# EAGLE design B250D (EAGLE 6.6.0)
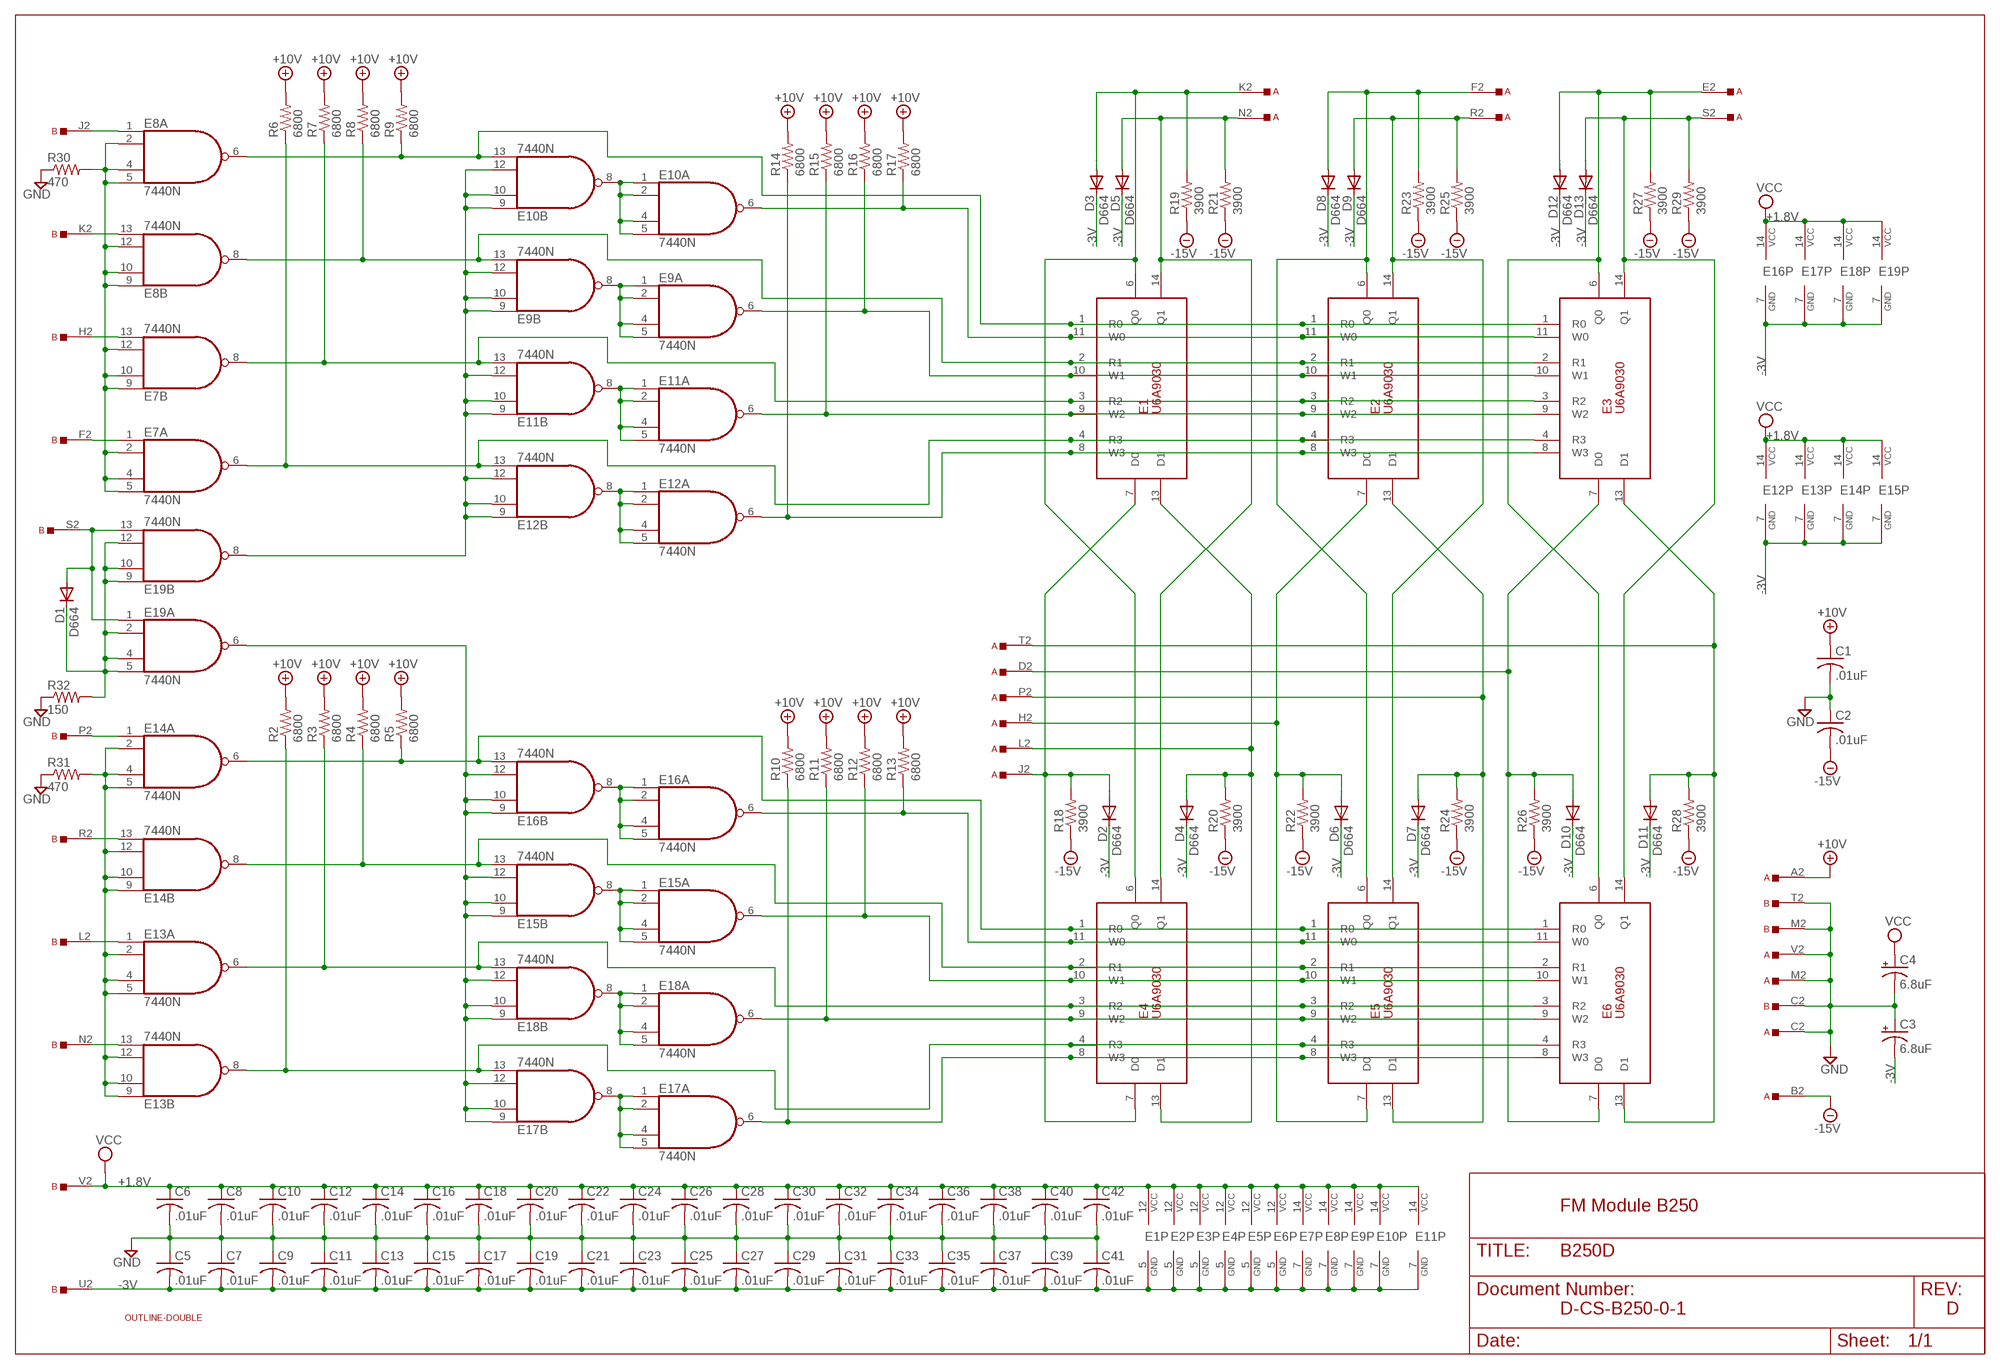
[diagram p0: schematic, sheet 1]

## Parts
A  SS-TOP  [EDGE-CON1]
B  SS-TOP  [EDGE-CON1]
C1  .01uF  C-US  [C063-025X075]
C2  .01uF  C-US  [C063-025X075]
C3  6.8uF  CPOL-USE15-5AXIAL  [E15-5]
C4  6.8uF  CPOL-USE15-5AXIAL  [E15-5]
C5  .01uF  C-US  [C063-025X075]
C6  .01uF  C-US  [C063-025X075]
C7  .01uF  C-US  [C063-025X075]
C8  .01uF  C-US  [C063-025X075]
C9  .01uF  C-US  [C063-025X075]
C10  .01uF  C-US  [C063-025X075]
C11  .01uF  C-US  [C063-025X075]
C12  .01uF  C-US  [C063-025X075]
C13  .01uF  C-US  [C063-025X075]
C14  .01uF  C-US  [C063-025X075]
C15  .01uF  C-US  [C063-025X075]
C16  .01uF  C-US  [C063-025X075]
C17  .01uF  C-US  [C063-025X075]
C18  .01uF  C-US  [C063-025X075]
C19  .01uF  C-US  [C063-025X075]
C20  .01uF  C-US  [C063-025X075]
C21  .01uF  C-US  [C063-025X075]
C22  .01uF  C-US  [C063-025X075]
C23  .01uF  C-US  [C063-025X075]
C24  .01uF  C-US  [C063-025X075]
C25  .01uF  C-US  [C063-025X075]
C26  .01uF  C-US  [C063-025X075]
C27  .01uF  C-US  [C063-025X075]
C28  .01uF  C-US  [C063-025X075]
C29  .01uF  C-US  [C063-025X075]
C30  .01uF  C-US  [C063-025X075]
C31  .01uF  C-US  [C063-025X075]
C32  .01uF  C-US  [C063-025X075]
C33  .01uF  C-US  [C063-025X075]
C34  .01uF  C-US  [C063-025X075]
C35  .01uF  C-US  [C063-025X075]
C36  .01uF  C-US  [C063-025X075]
C37  .01uF  C-US  [C063-025X075]
C38  .01uF  C-US  [C063-025X075]
C39  .01uF  C-US  [C063-025X075]
C40  .01uF  C-US  [C063-025X075]
C41  .01uF  C-US  [C063-025X075]
C42  .01uF  C-US  [C063-025X075]
D1  D664  DIODE-DO35-10  [DO35-10]
D2  D664  DIODE-DO35-10  [DO35-10]
D3  D664  DIODE-DO35-10  [DO35-10]
D4  D664  DIODE-DO35-10  [DO35-10]
D5  D664  DIODE-DO35-10  [DO35-10]
D6  D664  DIODE-DO35-10  [DO35-10]
D7  D664  DIODE-DO35-10  [DO35-10]
D8  D664  DIODE-DO35-10  [DO35-10]
D9  D664  DIODE-DO35-10  [DO35-10]
D10  D664  DIODE-DO35-10  [DO35-10]
D11  D664  DIODE-DO35-10  [DO35-10]
D12  D664  DIODE-DO35-10  [DO35-10]
D13  D664  DIODE-DO35-10  [DO35-10]
E1  U6A9030  [DIL14]
E2  U6A9030  [DIL14]
E3  U6A9030  [DIL14]
E4  U6A9030  [DIL14]
E5  U6A9030  [DIL14]
E6  U6A9030  [DIL14]
E7  7440N  [DIL14]
E8  7440N  [DIL14]
E9  7440N  [DIL14]
E10  7440N  [DIL14]
E11  7440N  [DIL14]
E12  7440N  [DIL14]
E13  7440N  [DIL14]
E14  7440N  [DIL14]
E15  7440N  [DIL14]
E16  7440N  [DIL14]
E17  7440N  [DIL14]
E18  7440N  [DIL14]
E19  7440N  [DIL14]
R2  6800  R-US_0207/10  [0207/10]
R3  6800  R-US_0207/10  [0207/10]
R4  6800  R-US_0207/10  [0207/10]
R5  6800  R-US_0207/10  [0207/10]
R6  6800  R-US_0207/10  [0207/10]
R7  6800  R-US_0207/10  [0207/10]
R8  6800  R-US_0207/10  [0207/10]
R9  6800  R-US_0207/10  [0207/10]
R10  6800  R-US_0207/10  [0207/10]
R11  6800  R-US_0207/10  [0207/10]
R12  6800  R-US_0207/10  [0207/10]
R13  6800  R-US_0207/10  [0207/10]
R14  6800  R-US_0207/10  [0207/10]
R15  6800  R-US_0207/10  [0207/10]
R16  6800  R-US_0207/10  [0207/10]
R17  6800  R-US_0207/10  [0207/10]
R18  3900  R-US_0207/10  [0207/10]
R19  3900  R-US_0207/10  [0207/10]
R20  3900  R-US_0207/10  [0207/10]
R21  3900  R-US_0207/10  [0207/10]
R22  3900  R-US_0207/10  [0207/10]
R23  3900  R-US_0207/10  [0207/10]
R24  3900  R-US_0207/10  [0207/10]
R25  3900  R-US_0207/10  [0207/10]
R26  3900  R-US_0207/10  [0207/10]
R27  3900  R-US_0207/10  [0207/10]
R28  3900  R-US_0207/10  [0207/10]
R29  3900  R-US_0207/10  [0207/10]
R30  470  R-US_0207/10  [0207/10]
R31  470  R-US_0207/10  [0207/10]
R32  150  R-US_0207/10  [0207/10]
U$1  OUTLINE-DOUBLE  [DOUBLE]

## Nets
+10V [supply]: A.A2 C1.1 R2.2 R3.2 R4.2 R5.2 R6.2 R7.2 R8.2 R9.2 R10.2 R11.2 R12.2 R13.2 R14.2 R15.2 R16.2 R17.2
-3V [supply]: B.U2 C3.- C5.2 C7.2 C9.2 C11.2 C13.2 C15.2 C17.2 C19.2 C21.2 C23.2 C25.2 C27.2 C29.2 C31.2 C33.2 C35.2 C37.2 C39.2 C41.2 D2.C D3.C D4.C D5.C D6.C D7.C D8.C D9.C D10.C D11.C D12.C D13.C E1.5(GND) E2.5(GND) E3.5(GND) E4.5(GND) E5.5(GND) E6.5(GND) E7.7(P:GND) E8.7(P:GND) E9.7(P:GND) E10.7(P:GND) E11.7(P:GND) E12.7(P:GND) E13.7(P:GND) E14.7(P:GND) E15.7(P:GND) E16.7(P:GND) E17.7(P:GND) E18.7(P:GND) E19.7(P:GND)
-15V [supply]: A.B2 C2.2 R18.1 R19.1 R20.1 R21.1 R22.1 R23.1 R24.1 R25.1 R26.1 R27.1 R28.1 R29.1
GND [supply]: A.C2 A.M2 A.V2 B.C2 B.M2 B.T2 C1.2 C2.1 C3.+ C4.- C5.1 C6.2 C7.1 C8.2 C9.1 C10.2 C11.1 C12.2 C13.1 C14.2 C15.1 C16.2 C17.1 C18.2 C19.1 C20.2 C21.1 C22.2 C23.1 C24.2 C25.1 C26.2 C27.1 C28.2 C29.1 C30.2 C31.1 C32.2 C33.1 C34.2 C35.1 C36.2 C37.1 C38.2 C39.1 C40.2 C41.1 C42.2 R30.1 R31.1 R32.1
N$1: E13.2(A:I1) E13.4(A:I2) E13.5(A:I3) E13.9(B:I0) E13.10(B:I1) E13.12(B:I2) E14.2(A:I1) E14.4(A:I2) E14.5(A:I3) E14.9(B:I0) E14.10(B:I1) E14.12(B:I2) R31.2
N$2: E7.2(A:I1) E7.4(A:I2) E7.5(A:I3) E7.9(B:I0) E7.10(B:I1) E7.12(B:I2) E8.2(A:I1) E8.4(A:I2) E8.5(A:I3) E8.9(B:I0) E8.10(B:I1) E8.12(B:I2) R30.2
N$3: B.S2 D1.A E19.1(A:I0) E19.13(B:I3)
N$4: D1.C E19.2(A:I1) E19.4(A:I2) E19.5(A:I3) E19.9(B:I0) E19.10(B:I1) E19.12(B:I2) R32.2
N$5: E17.1(A:I0) E17.2(A:I1) E17.4(A:I2) E17.5(A:I3) E17.8(B:O)
N$6: E18.1(A:I0) E18.2(A:I1) E18.4(A:I2) E18.5(A:I3) E18.8(B:O)
N$7: E15.1(A:I0) E15.2(A:I1) E15.4(A:I2) E15.5(A:I3) E15.8(B:O)
N$8: E16.1(A:I0) E16.2(A:I1) E16.4(A:I2) E16.5(A:I3) E16.8(B:O)
N$9: E12.1(A:I0) E12.2(A:I1) E12.4(A:I2) E12.5(A:I3) E12.8(B:O)
N$10: E11.1(A:I0) E11.2(A:I1) E11.4(A:I2) E11.5(A:I3) E11.8(B:O)
N$11: E9.1(A:I0) E9.2(A:I1) E9.4(A:I2) E9.5(A:I3) E9.8(B:O)
N$12: E10.1(A:I0) E10.2(A:I1) E10.4(A:I2) E10.5(A:I3) E10.8(B:O)
N$13: B.H2 E7.13(B:I3)
N$14: B.J2 E8.1(A:I0)
N$15: B.K2 E8.13(B:I3)
N$16: B.F2 E7.1(A:I0)
N$17: B.L2 E13.1(A:I0)
N$18: B.P2 E14.1(A:I0)
N$19: B.R2 E14.13(B:I3)
N$20: B.N2 E13.13(B:I3)
N$21: E15.9(B:I0) E15.10(B:I1) E15.12(B:I2) E16.9(B:I0) E16.10(B:I1) E16.12(B:I2) E17.9(B:I0) E17.10(B:I1) E17.12(B:I2) E18.9(B:I0) E18.10(B:I1) E18.12(B:I2) E19.6(A:O)
N$22: E9.9(B:I0) E9.10(B:I1) E9.12(B:I2) E10.9(B:I0) E10.10(B:I1) E10.12(B:I2) E11.9(B:I0) E11.10(B:I1) E11.12(B:I2) E12.9(B:I0) E12.10(B:I1) E12.12(B:I2) E19.8(B:O)
N$23: E1.4(R3) E2.4(R3) E3.4(R3) E7.6(A:O) E12.13(B:I3) R6.1
N$24: E1.3(R2) E2.3(R2) E3.3(R2) E7.8(B:O) E11.13(B:I3) R7.1
N$25: E1.2(R1) E2.2(R1) E3.2(R1) E8.8(B:O) E9.13(B:I3) R8.1
N$26: E1.1(R0) E2.1(R0) E3.1(R0) E8.6(A:O) E10.13(B:I3) R9.1
N$27: E4.4(R3) E5.4(R3) E6.4(R3) E13.8(B:O) E17.13(B:I3) R2.1
N$28: E4.3(R2) E5.3(R2) E6.3(R2) E13.6(A:O) E18.13(B:I3) R3.1
N$29: E4.2(R1) E5.2(R1) E6.2(R1) E14.8(B:O) E15.13(B:I3) R4.1
N$30: E4.1(R0) E5.1(R0) E6.1(R0) E14.6(A:O) E16.13(B:I3) R5.1
N$31: E1.8(W3) E2.8(W3) E3.8(W3) E12.6(A:O) R14.1
N$32: E1.9(W2) E2.9(W2) E3.9(W2) E11.6(A:O) R15.1
N$33: E1.10(W1) E2.10(W1) E3.10(W1) E9.6(A:O) R16.1
N$34: E1.11(W0) E2.11(W0) E3.11(W0) E10.6(A:O) R17.1
N$35: E4.8(W3) E5.8(W3) E6.8(W3) E17.6(A:O) R10.1
N$36: E4.11(W0) E5.11(W0) E6.11(W0) E16.6(A:O) R13.1
N$37: E4.10(W1) E5.10(W1) E6.10(W1) E15.6(A:O) R12.1
N$38: E4.9(W2) E5.9(W2) E6.9(W2) E18.6(A:O) R11.1
N$39: A.J2 D2.A E1.7(D0) E4.7(D0) R18.2
N$40: A.K2 D3.A E1.6(Q0) E4.6(Q0) R19.2
N$41: A.N2 D5.A E1.14(Q1) E4.14(Q1) R21.2
N$42: A.F2 D8.A E2.6(Q0) E5.6(Q0) R23.2
N$43: A.L2 D4.A E1.13(D1) E4.13(D1) R20.2
N$44: A.H2 D6.A E2.7(D0) E5.7(D0) R22.2
N$45: A.P2 D7.A E2.13(D1) E5.13(D1) R24.2
N$46: A.D2 D10.A E3.7(D0) E6.7(D0) R26.2
N$47: A.R2 D9.A E2.14(Q1) E5.14(Q1) R25.2
N$48: A.S2 D13.A E3.14(Q1) E6.14(Q1) R29.2
N$49: A.E2 D12.A E3.6(Q0) E6.6(Q0) R27.2
N$52: A.T2 D11.A E3.13(D1) E6.13(D1) R28.2
VCC [supply]: B.V2 C4.+ C6.1 C8.1 C10.1 C12.1 C14.1 C16.1 C18.1 C20.1 C22.1 C24.1 C26.1 C28.1 C30.1 C32.1 C34.1 C36.1 C38.1 C40.1 C42.1 E1.12(VCC) E2.12(VCC) E3.12(VCC) E4.12(VCC) E5.12(VCC) E6.12(VCC) E7.14(P:VCC) E8.14(P:VCC) E9.14(P:VCC) E10.14(P:VCC) E11.14(P:VCC) E12.14(P:VCC) E13.14(P:VCC) E14.14(P:VCC) E15.14(P:VCC) E16.14(P:VCC) E17.14(P:VCC) E18.14(P:VCC) E19.14(P:VCC)
Unconnected: A.U2 B.A2 B.B2 B.D2 B.E2 E7.3(3:NC) E7.11(11:NC) E8.3(3:NC) E8.11(11:NC) E9.3(3:NC) E9.11(11:NC) E10.3(3:NC) E10.11(11:NC) E11.3(3:NC) E11.11(11:NC) E12.3(3:NC) E12.11(11:NC) E13.3(3:NC) E13.11(11:NC) E14.3(3:NC) E14.11(11:NC) E15.3(3:NC) E15.11(11:NC) E16.3(3:NC) E16.11(11:NC) E17.3(3:NC) E17.11(11:NC) E18.3(3:NC) E18.11(11:NC) E19.3(3:NC) E19.11(11:NC)

## Notes on the sheet
- +1.8V
- +1.8V
- +1.8V
- FM Module B250
- D-CS-B250-0-1 | D

## Library data of the parts
A B = dec-con:SS-TOP: Single Sided Top Connector. Also suitable for building wider single-sided modules.
C1 C2 C5-C42 = dec-con:C-US: Capacitors with funky DEC lead spacing.
C3 C4 = dec-con:CPOL-USE15-5AXIAL: 0.6" version of an electrolytic
D1-D13 = diode:DIODE-: DIODE
E1-E6 = dec-con:U6A9030: 4x2 Memory
E7-E19 = dec-con:74*40: Dual 4-input NAND gate
R2-R32 = rcl:R-US_: RESISTOR, American symbol
U$1 = dec-con:OUTLINE-*: Board outlines for DEC boards.

## Net classes
0 default: width 0.61 mm
1 supply: width 0.813 mm

## Board
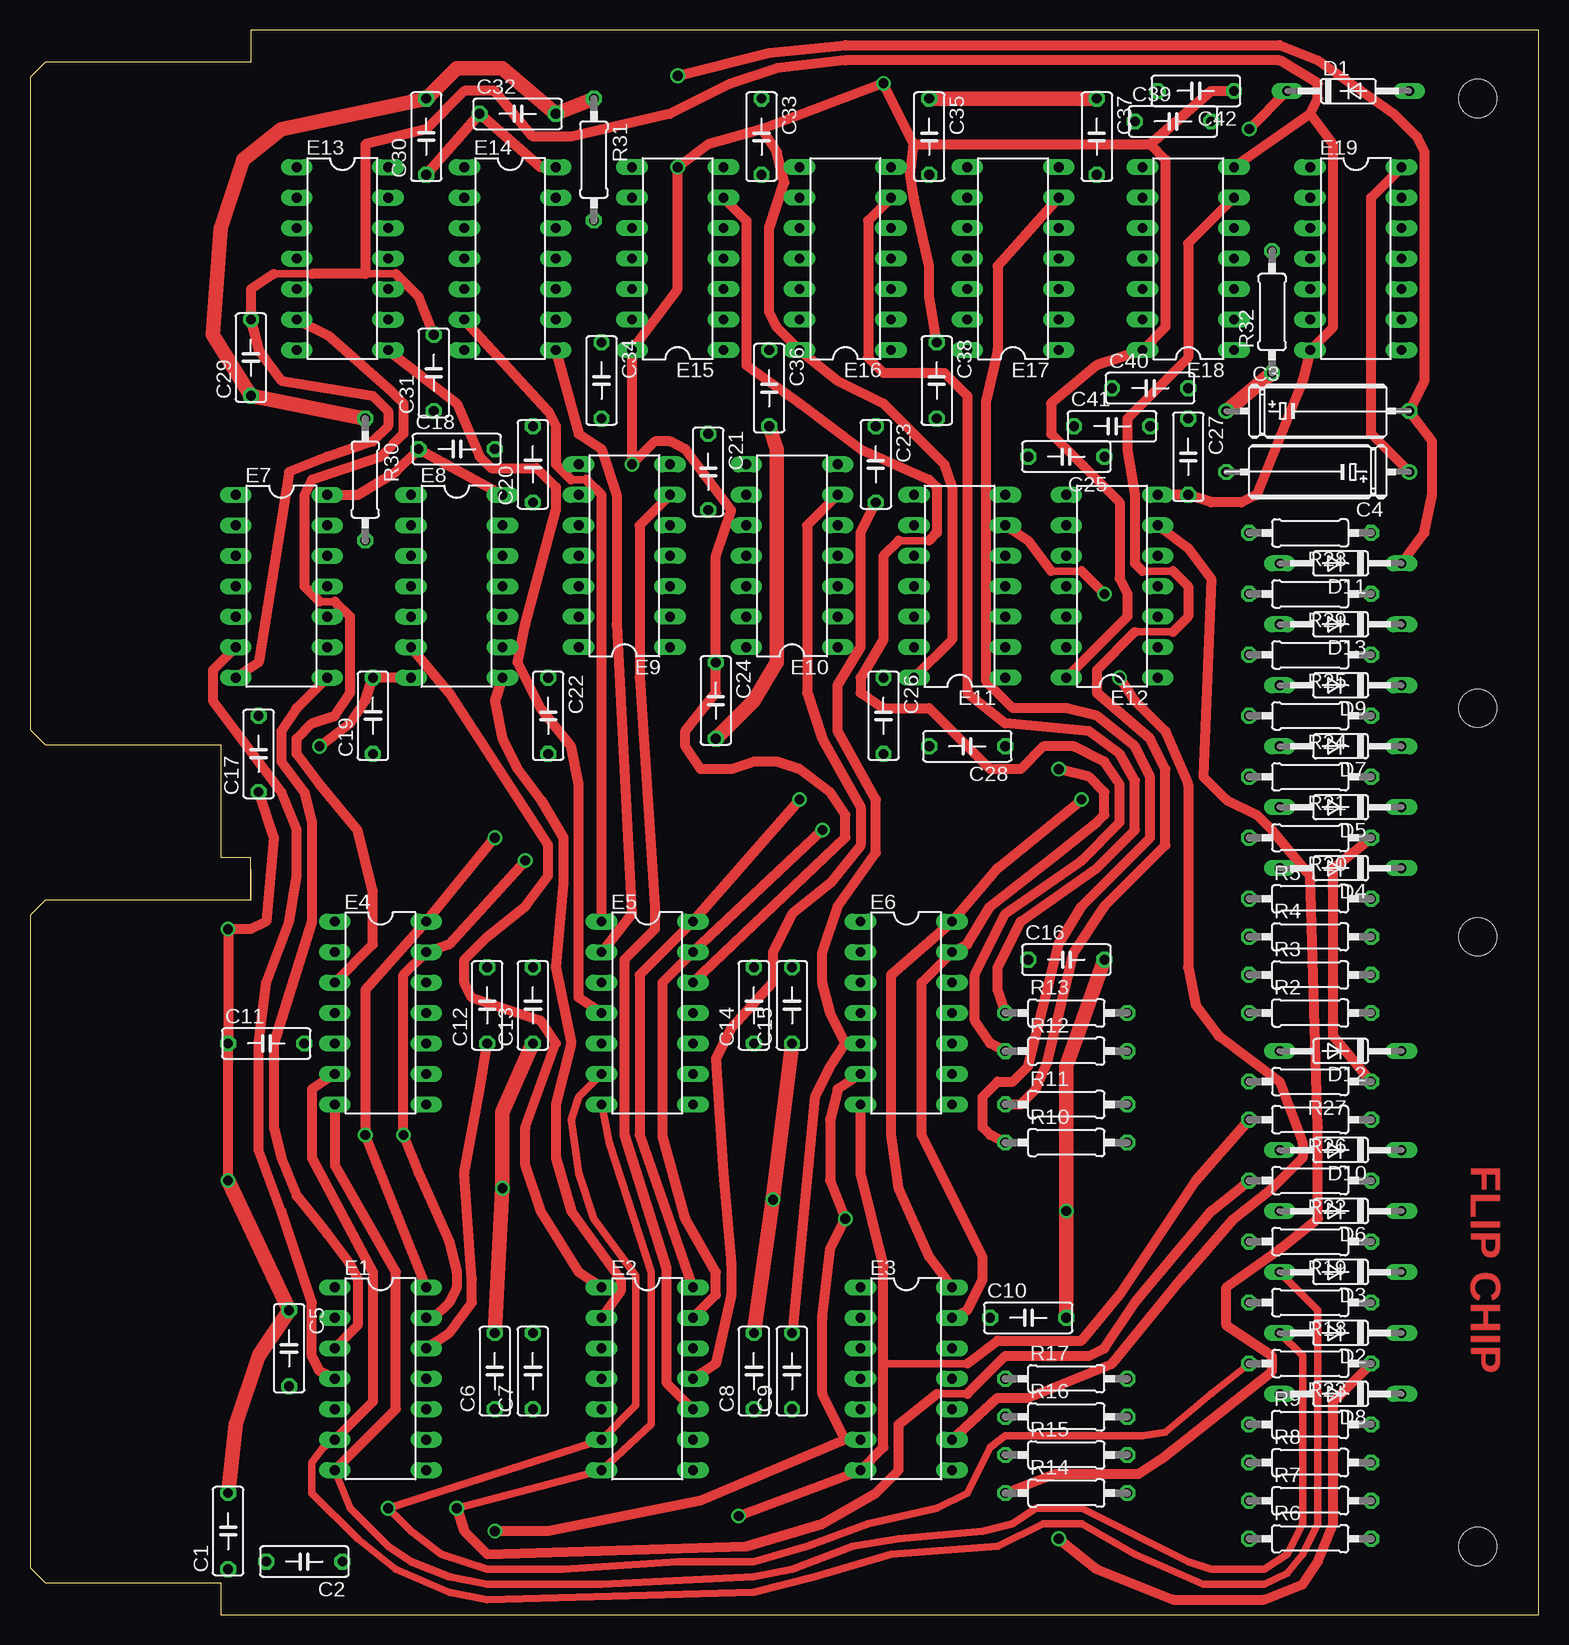
[diagram p1: board, top side]
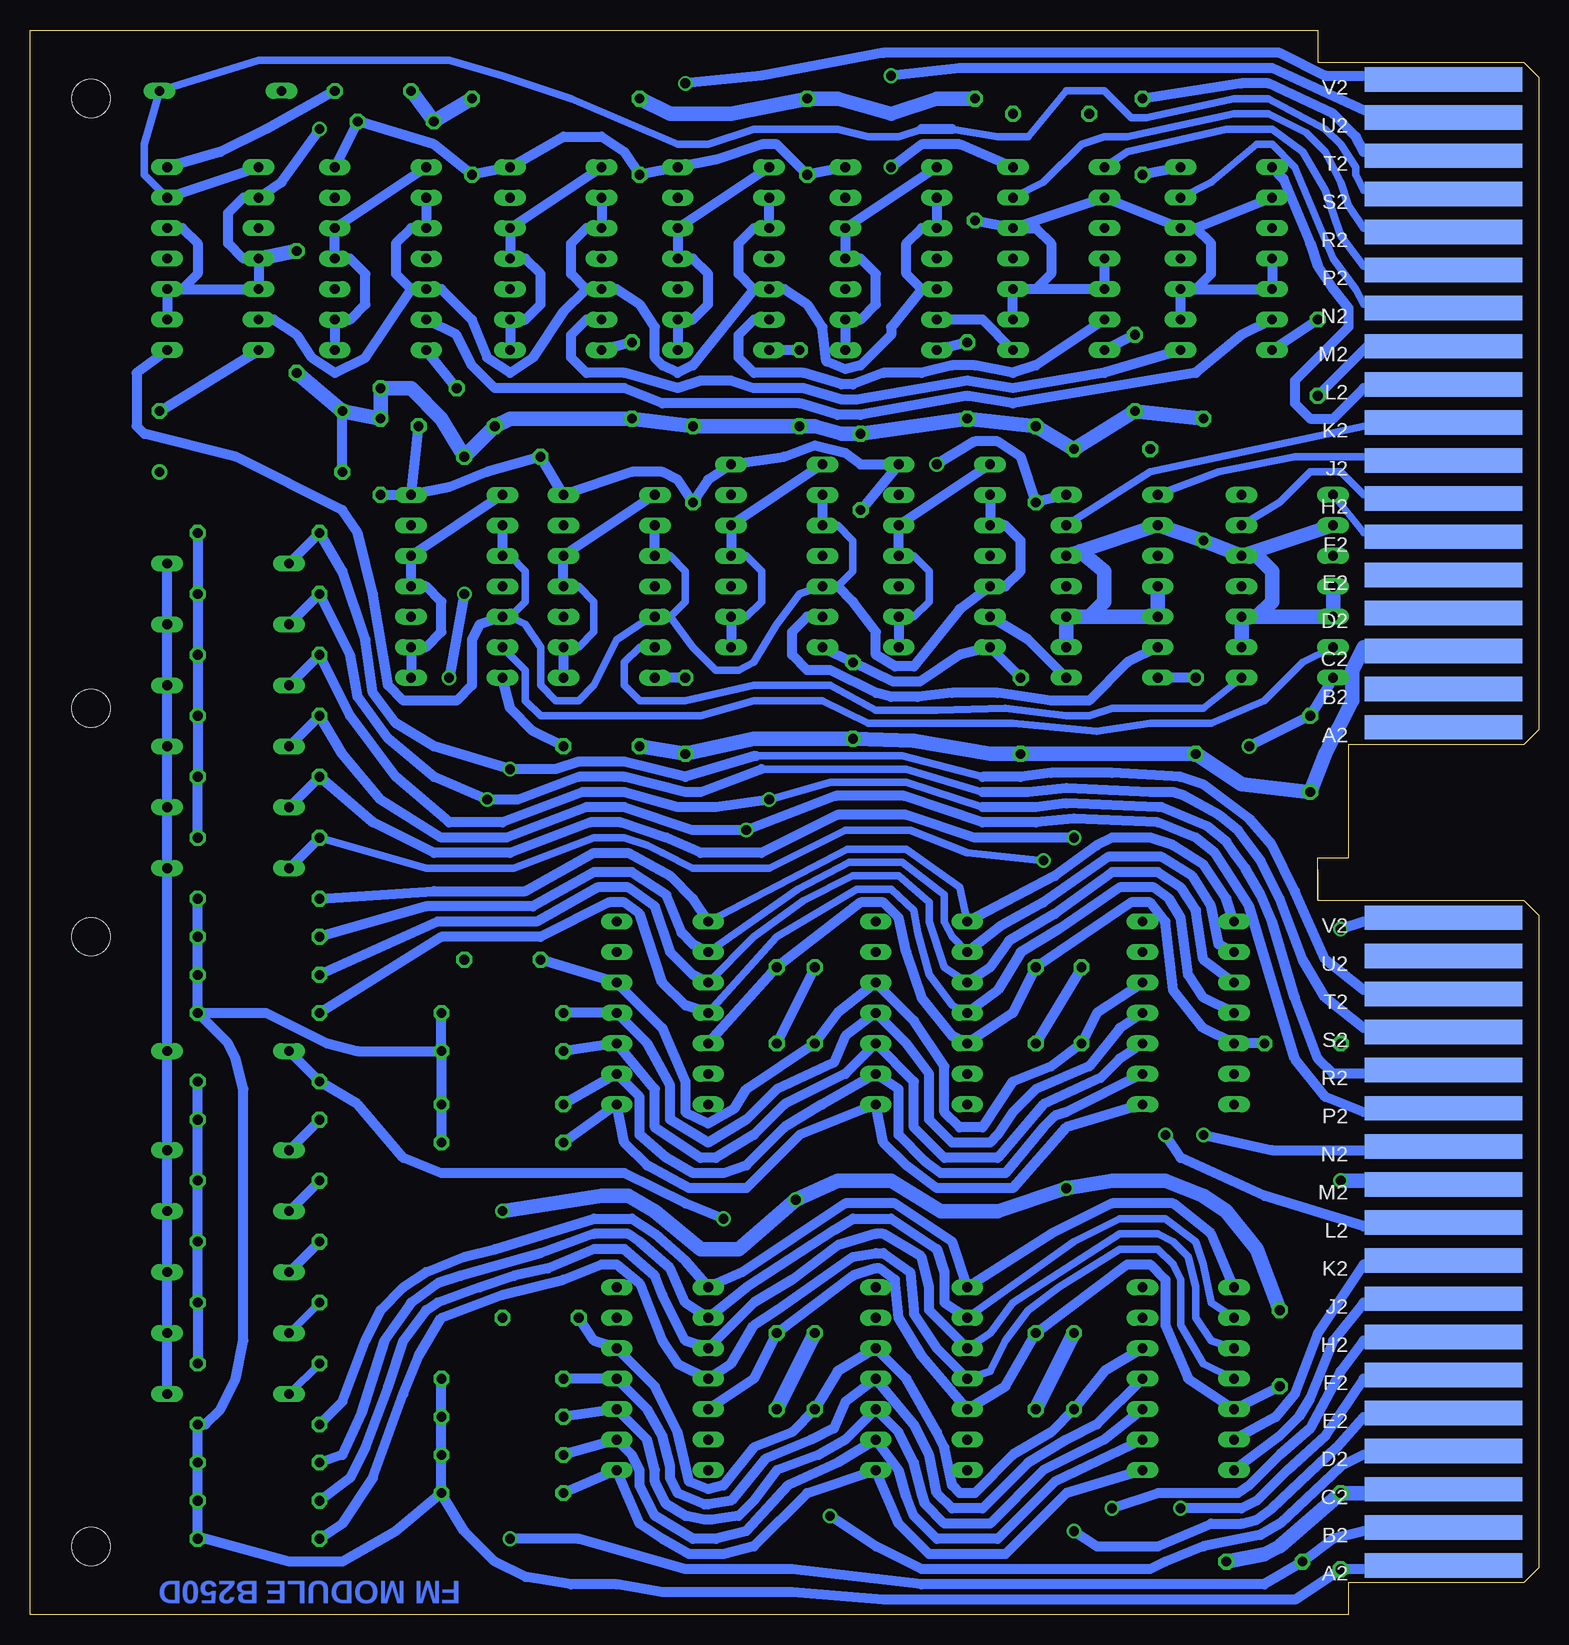
[diagram p2: board, bottom side, seen from below]

Size 125.73 x 132.08 mm. Coordinates in mm from the lower left corner, seen from the top.
Copper layers (1+16): Top 0.035mm / dielectric 1.5mm / Bottom 0.035mm
Design rules "16mils *": minimum track width 16mil, minimum drill 32mil, track to track 15mil, track to pad 10mil, pad to pad 10mil, via to via 10mil, smd to smd 10mil, copper to edge 13mil, drill to drill 10mil, minimum pad ring 10mil, minimum via ring 8mil, stop-mask expansion 0mil, vias tented up to drill 0mil, thermal gap 10mil

### Footprints (pad centres in the part's own frame; a part is rotated, then mirrored left to right if it is on the bottom)
EDGE-CON1 = smd 13.106 x 2.032 bottom: A2 7.938,4.128; B2 7.938,7.303; C2 7.938,10.477; D2 7.938,13.652; E2 7.938,16.828; F2 7.938,20.003; H2 7.938,23.177; J2 7.938,26.352; K2 7.938,29.527; L2 7.938,32.703; M2 7.938,35.877; N2 7.938,39.053; P2 7.938,42.227; R2 7.938,45.403; S2 7.938,48.578; T2 7.938,51.752; U2 7.938,54.928; V2 7.938,58.102
C063-025X075 = drill 0.813 octagon: 1 -2.54,0; 2 3.81,0
E15-5 = drill 0.813: + -7.62,0 | drill 0.813 octagon: - 7.62,0
DO35-10 = drill 0.813 long: A 5.08,0; C -5.08,0
DIL14 = drill 0.813 long: 1 -7.62,-3.81; 2 -5.08,-3.81; 3 -2.54,-3.81; 4 0,-3.81; 5 2.54,-3.81; 6 5.08,-3.81; 7 7.62,-3.81; 8 7.62,3.81; 9 5.08,3.81; 10 2.54,3.81; 11 0,3.81; 12 -2.54,3.81; 13 -5.08,3.81; 14 -7.62,3.81
0207/10 = drill 0.813 octagon: 1 -5.08,0; 2 5.08,0
DOUBLE = hole 3.175: 120.65,56.515; 120.65,5.715; 120.65,75.565; 120.65,126.365

### Placement (x,y rotation side)
A  0,0 0 top
B  0,69.85 0 top
C1  16.51,6.35 90 top
C2  23.5,4.45 180 top
C3  107.32,100.33 0 top
C4  107.32,95.25 180 top
C5  21.59,22.86 270 top
C6  38.74,19.68 90 top
C7  41.91,19.68 90 top
C8  60.33,19.68 90 top
C9  63.5,19.68 90 top
C10  82.55,24.77 0 top
C11  19.05,47.62 0 top
C12  38.1,50.16 90 top
C13  41.91,50.16 90 top
C14  60.33,50.16 90 top
C15  63.5,50.16 90 top
C16  85.73,54.61 0 top
C17  19.05,71.12 90 top
C18  34.93,97.16 0 top
C19  28.58,74.3 90 top
C20  41.91,95.25 90 top
C21  56.52,95.89 270 top
C22  43.18,75.56 270 top
C23  70.49,96.52 270 top
C24  57.15,76.83 270 top
C25  87,96.52 180 top
C26  71.12,75.56 270 top
C27  96.52,97.16 270 top
C28  78.74,72.39 180 top
C29  18.42,104.14 90 top
C30  33.02,122.56 90 top
C31  33.66,102.87 90 top
C32  40.01,125.09 0 top
C33  60.96,123.83 270 top
C34  47.63,103.5 270 top
C35  74.93,123.83 270 top
C36  61.6,102.87 270 top
C37  88.9,123.83 270 top
C38  75.57,103.5 270 top
C39  94.62,124.46 0 top
C40  92.71,102.23 0 top
C41  89.54,99.06 0 top
C42  97.79,127 180 top
D1  109.86,127 0 top
D2  109.22,23.5 180 top
D3  109.22,28.57 180 top
D4  109.22,62.23 180 top
D5  109.22,67.31 180 top
D6  109.22,33.66 180 top
D7  109.22,72.39 180 top
D8  109.22,18.41 180 top
D9  109.22,77.47 180 top
D10  109.22,38.73 180 top
D11  109.22,87.63 180 top
D12  109.22,46.99 180 top
D13  109.22,82.55 180 top
E1  29.21,19.68 270 top
E2  51.44,19.68 270 top
E3  73.03,19.68 270 top
E4  29.21,50.16 270 top
E5  51.44,50.16 270 top
E6  73.03,50.16 270 top
E7  20.96,85.72 270 top
E8  35.56,85.72 270 top
E9  49.53,88.27 90 top
E10  63.5,88.27 90 top
E11  77.47,85.72 90 top
E12  90.17,85.72 90 top
E13  26.04,113.03 270 top
E14  40.01,113.03 270 top
E15  53.98,113.03 90 top
E16  67.95,113.03 90 top
E17  81.92,113.03 90 top
E18  96.52,113.03 90 top
E19  110.49,113.03 270 top
R2  106.68,50.16 0 top
R3  106.68,53.34 0 top
R4  106.68,56.52 0 top
R5  106.68,59.69 0 top
R6  106.68,6.35 0 top
R7  106.68,9.53 0 top
R8  106.68,12.7 0 top
R9  106.68,15.88 0 top
R10  86.36,39.37 0 top
R11  86.36,42.55 0 top
R12  86.36,46.99 0 top
R13  86.36,50.16 0 top
R14  86.36,10.16 0 top
R15  86.36,13.34 0 top
R16  86.36,16.51 0 top
R17  86.36,19.68 0 top
R18  106.68,26.04 180 top
R19  106.68,31.11 180 top
R20  106.68,64.77 180 top
R21  106.68,69.85 180 top
R22  106.68,36.2 180 top
R23  106.68,20.95 180 top
R24  106.68,74.93 180 top
R25  106.68,80.01 180 top
R26  106.68,41.27 180 top
R27  106.68,44.45 180 top
R28  106.68,90.17 180 top
R29  106.68,85.09 180 top
R30  27.94,94.61 270 top
R31  46.99,121.28 270 top
R32  103.51,108.58 90 top
U$1  0,0 0 top

### Tracks (layer width: path | path; a pad name or v marks a point on that pad's centre or on a via)
+10V
  Bottom 0.813: A.A2 10.16,3.81 C1.1 20.32,1.27 54.61,1.27 62.23,1.91 73.03,1.91 76.84,2.54 80.65,2.54 84.46,3.17 87,4.45 89.54,6.99 R14.2 | R14.2 R15.2 R16.2 R17.2 | R14.2 95.25,6.99 99.7,4.45 104.14,4.45 111.13,6.35 R6.2 R7.2 R8.2 R9.2 111.13,15.88 109.86,17.14 108.59,19.68 107.95,22.86 107.95,43.81 108.59,46.35 109.22,47.62 R2.2 | R2.2 R3.2 R4.2 R5.2 | R2.2 106.05,50.16 100.97,47.62 98.43,46.99 R12.2 | R12.2 R13.2 | R12.2 R11.2 R10.2
-3V  (via drill 0.81)
  Top 0.61: 30.48,111.76 27.94,111.76 | 23.5,111.76 20.32,111.76
  Top 0.813: v53.98,128.27 61.6,130.18 67.95,130.81 104.14,130.81 107.32,129.54 113.67,125.09 115.57,123.19 116.21,121.92 116.21,102.87 C3.- 116.84,97.79 116.84,93.34 116.21,90.17 D11.C | v24.13,72.39 26.67,74.3 27.94,76.2 C19.2 E8.7 | 106.68,125.09 108.59,122.56 108.59,107.31 E19.7 106.05,102.87 102.24,93.34 100.97,92.71 98.43,92.71 C27.2 E12.7 | 106.68,125.09 E18.7 | C31.2 32.39,109.86 30.48,111.76 | 23.5,111.76 27.94,111.76 27.94,122.56 33.02,123.83 36.2,127 38.74,127 41.91,123.19 45.09,123.19 53.34,125.09 58.42,127.64 62.23,128.91 67.95,129.54 104.14,129.54 107.32,127.64 107.32,126.36 106.68,125.09 | 20.32,111.76 18.42,110.49 C29.2 19.05,105.41 20.96,102.87 28.58,101.6 29.85,100.33 29.85,99.06 28.58,97.79 24.77,96.52 21.59,95.25 19.05,79.38 E7.7 | E6.5 67.95,47.62 | 67.95,47.62 66.68,45.72 65.41,43.18 C9.2 | 67.95,47.62 66.68,50.16 66.04,52.7 66.04,55.24 67.31,59.05 70.49,63.5 70.49,67.94 67.31,73.66 67.31,77.47 69.22,80.64 69.22,90.17 C23.2
  Bottom 0.813: B.U2 8.26,125.09 13.97,125.09 22.23,128.91 48.26,128.91 v53.98,128.27 | C3.- E19.7 | C5.2 E1.5 29.21,19.68 31.12,24.13 31.12,27.94 32.39,29.21 34.29,29.21 C7.2 44.45,19.05 E2.5 51.44,21.59 53.34,24.77 53.66,27.94 54.93,28.89 55.25,28.89 57.15,28.26 C9.2 65.41,19.68 E3.5 | C11.2 E4.5 27.94,48.9 30.48,52.07 31.12,57.78 32.39,59.37 33.97,59.37 C13.2 43.82,50.16 E5.5 48.9,48.26 51.44,51.44 52.71,55.24 53.34,58.1 54.61,59.37 56.52,59.37 C15.2 E6.5 | E7.7 C17.2 v24.13,72.39 | C19.2 E8.7 | C29.2 E13.7 | D8.C D2.C D3.C D6.C D10.C D12.C D4.C D5.C D7.C D9.C D13.C D11.C | E12.7 C41.2 | C27.2 E12.7 | E12.7 90.81,93.98 87.63,95.25 C25.2 E11.7 75.57,95.25 73.03,95.25 71.76,94.61 C23.2 69.22,94.61 E10.7 62.87,96.52 60.33,97.47 57.79,96.84 56.52,95.89 E9.7 C21.2 | C31.2 E14.7 | E15.7 C33.2 63.5,122.56 64.77,122.56 68.58,121.28 E16.7 C35.2 76.2,121.92 78.11,123.19 81.28,123.19 E17.7 C37.2 92.08,122.56 C39.2 E18.7
-15V  (via drill 0.81)
  Top 0.813: v85.73,6.35 88.9,3.81 95.25,1.27 102.87,1.27 106.05,2.54 107.32,4.45 108.59,7.62 108.59,17.78 R23.1 | R27.1 108.59,48.26 108.59,62.23 R20.1
  Bottom 0.813: A.B2 8.89,6.99 14.61,6.99 17.15,6.35 C2.2 22.86,2.54 51.44,2.54 62.23,3.81 71.12,3.81 80.01,6.35 v85.73,6.35 | R23.1 R18.1 R19.1 R22.1 R26.1 R27.1 | R20.1 R21.1 R24.1 R25.1 R29.1 R28.1
GND  (via drill 0.81)
  Top 0.813: C17.1 20.32,64.77 19.69,57.78 18.42,57.15 v16.51,57.15 C11.1 v16.51,36.2
  Top 1.219: v16.51,36.2 C5.1 19.05,21.59 17.15,15.88 C1.2 | C10.2 v86.36,33.66 86.36,45.72 C16.2 | C6.2 v39.37,35.56 39.37,41.91 C13.1 | R30.1 C29.1 15.24,106.68 15.88,115.57 17.78,121.28 20.96,123.83 C30.2 35.56,128.91 39.37,128.91 C32.2 R31.1 | C35.1 C37.1 | C8.2 v61.91,34.61 | v61.91,34.61 61.91,34.65 | R32.1 C3.+ | C15.1 v61.91,34.61 | C24.2 60.33,76.2 62.23,79.38 62.23,97.16 C36.2
  Bottom 0.813: B.T2 8.89,121.92 14.61,121.92 15.24,123.19 17.15,125.09 22.54,127.64 24.77,127.64 C30.2 | C4.- C3.+ | B.M2 8.89,106.05 13.97,106.05 C29.1 | C12.2 C13.1 | A.V2 14.61,57.78 v16.51,57.15 | C14.2 C15.1
  Bottom 1.219: B.C2 8.89,80.64 14.61,80.64 15.56,78.74 15.56,76.2 17.78,71.75 C17.1 24.77,69.22 C19.1 C22.2 45.72,71.75 52.07,72.87 C24.2 65.41,73.03 C26.2 C28.2 | A.C2 8.89,10.16 C1.2 21.59,5.71 22.86,5.08 C2.1 | A.M2 8.89,36.2 v16.51,36.2 | C5.1 23.5,30.48 26.04,33.66 27.94,34.92 31.12,36.2 35.56,36.2 v39.37,35.56 45.09,33.66 49.85,33.66 53.98,36.2 58.42,36.2 v61.91,34.61 66.68,30.48 69.85,30.48 73.66,33.66 75.88,34.92 78.11,34.92 v86.36,33.66 | C6.2 C7.1 | R30.1 C31.1 C18.2 C20.2 C34.2 C21.1 58.1,98.42 60.33,99.06 C36.2 C23.1 C38.2 85.73,99.69 C41.1 C25.1 91.44,99.69 93.98,102.23 C40.2 C27.1 C3.+ R32.1 | R31.1 50.17,126.36 53.98,125.09 58.42,126.36 C33.1 67.31,125.09 72.39,125.09 C35.1 | C37.1 C39.1 C42.2 | C8.2 C9.1
N$1
  Bottom 0.813: 41.91,110.49 E14.5 E14.4 | 41.91,110.49 E14.10 E14.9 | E14.12 E14.2 E13.12 28.58,115.57 | E13.2 28.58,115.57 | 28.58,110.49 E13.5 E13.4 | E13.9 E13.10 28.58,110.49 | E14.12 41.91,115.57 40.64,114.3 40.64,111.76 41.91,110.49 | E14.12 R31.2 | 28.58,110.49 27.31,111.76 27.31,114.3 28.58,115.57
N$2
  Bottom 1.219: E7.4 E7.5 23.5,83.19 | 23.5,83.19 E7.10 E7.9 | E7.12 23.5,88.27 22.23,87 22.23,84.45 23.5,83.19 | E7.2 E7.12 | E7.12 R30.2 E8.2 38.23,88.65 | 38.23,88.65 E8.12 | E8.4 E8.5 37.47,83.19 | 37.47,83.19 E8.10 E8.9 | 37.47,83.19 36.2,84.45 36.2,87 38.23,88.65
N$3
  Bottom 0.61: B.S2 8.26,118.75 14.61,118.75 15.24,120.02 15.24,120.65 16.51,122.56 17.78,123.83 22.54,126.36 25.4,126.36 32.7,124.78 33.97,124.78 36.2,127 39.37,127 42.55,123.19 45.09,123.19 48.9,123.83 | 51.44,123.83 53.34,123.19 55.88,123.19 58.42,123.83 65.41,123.83 69.22,122.56 71.76,122.56 80.65,126.36 86.36,128.27 90.81,129.54 106.68,129.54 D1.A 116.21,122.56 116.21,120.02 E19.13
  Bottom 0.813: 48.9,123.83 51.44,123.83 | E19.1 E19.13
N$4  (via drill 0.81)
  Top 0.813: D1.C v101.6,123.83
  Bottom 0.813: v101.6,123.83 104.78,119.38 E19.2 107.95,118.11 109.22,116.84 109.22,114.3 107.95,113.03 E19.4 E19.5 113.03,110.49 | 113.03,110.49 E19.10 E19.9 | E19.12 113.03,115.57 111.76,114.3 111.76,111.76 113.03,110.49
  Bottom 1.219: R32.2 E19.4
N$5
  Bottom 0.813: E17.1 E17.2 84.46,107.95 83.19,109.22 83.19,111.76 84.46,113.03 E17.4 E17.5 E17.8
N$6
  Bottom 0.813: E18.8 E18.5 E18.4 99.06,113.03 97.79,111.76 97.79,109.22 99.06,107.95 E18.2 E18.1
N$7
  Bottom 0.813: E15.8 E15.5 E15.4 56.52,113.03 55.25,111.76 55.25,109.22 56.52,107.95 E15.2 E15.1
N$8
  Bottom 0.813: E16.1 E16.2 70.49,107.95 69.22,109.22 69.22,111.76 70.49,113.03 E16.4 E16.5 E16.8
N$9
  Bottom 0.813: E12.8 E12.5 E12.4 92.71,85.72 91.44,84.45 91.44,81.92 92.71,80.64 E12.2 E12.1
N$10
  Bottom 0.61: E11.2 80.01,80.64 78.74,81.92 78.74,84.45 80.01,85.72 E11.4
  Bottom 0.813: E11.2 E11.1 | E11.4 E11.5 E11.8
N$11
  Bottom 0.61: E9.2 52.07,83.19 50.8,84.45 50.8,87 52.07,88.27 E9.4
  Bottom 0.813: E9.8 E9.5 E9.4 | E9.2 E9.1
N$12
  Bottom 0.61: E10.2 66.04,83.19 64.77,84.45 64.77,87 66.04,88.27 E10.4
  Bottom 0.813: E10.8 E10.5 E10.4 | E10.2 E10.1
N$13
  Bottom 0.61: B.H2 8.89,93.34 14.61,93.34 16.51,95.25 19.05,95.25 21.59,92.71 E7.13
N$14
  Bottom 0.61: B.J2 8.89,96.52 20.32,96.52 26.67,95.25 E8.1
N$15
  Bottom 0.61: B.K2 8.89,99.06 14.61,99.06 32.39,95.25 E8.13
N$16
  Bottom 0.61: B.F2 9.53,90.17 14.61,90.17 E7.1
N$17
  Bottom 0.813: E13.1 21.27,119.7 19.05,114.3 18.42,112.39 17.15,110.49 15.88,108.9 15.88,107.31 20.32,102.87 20.32,100.97 19.05,99.69 17.15,99.69 14.61,102.23 8.26,102.23 B.L2
N$18
  Bottom 0.61: E14.1 34.29,121.92 26.04,123.83 22.23,123.83 19.69,121.92 17.78,118.75 16.51,114.94 14.61,112.39 8.26,112.39 B.P2
N$19
  Bottom 0.61: B.R2 9.53,115.57 14.61,115.57 15.88,117.47 16.51,119.38 17.78,121.92 19.37,123.51 22.54,125.09 25.4,125.09 34.29,123.19 36.2,123.19 38.1,122.56 41.28,119.38 E14.13
N$20
  Bottom 0.61: B.N2 8.89,109.22 14.61,109.22 15.24,110.49 17.15,113.03 20.32,120.65 22.23,122.56 23.5,122.56 27.31,119.38 E13.13
N$21
  Bottom 0.813: E18.9 E18.10 93.98,115.57 95.25,114.3 95.25,111.76 93.98,110.49 | E17.9 E17.10 79.38,115.57 80.65,114.3 80.65,111.76 79.38,110.49 | E15.9 E15.10 51.44,115.57 52.71,114.3 52.71,111.76 51.44,110.49 | E16.9 E16.10 65.41,115.57 66.68,114.3 66.68,111.76 65.41,110.49 | E15.12 51.44,110.49 | 65.41,110.49 E16.12 62.87,110.49 60.96,109.22 59.69,107.31 59.37,104.46 57.79,103.82 56.52,104.14 53.98,106.68 53.98,107.31 51.44,110.49 | 65.41,110.49 70.49,104.14 71.76,103.5 73.03,104.14 73.66,104.78 73.66,107.31 74.93,109.22 76.84,110.49 E17.12 79.38,110.49 | 93.98,110.49 E18.12 91.44,110.49 88.9,107.95 87.63,104.78 85.73,103.5 83.82,104.78 81.28,108.58 79.38,110.49 | E19.6 105.41,107.95 103.51,106.68 102.24,104.78 100.33,103.5 97.79,104.78 93.98,110.49
N$22
  Bottom 0.61: 85.73,83.19 84.46,82.55 83.19,80.64 83.19,77.47 81.92,76.2 80.01,76.2 78.74,77.47 76.84,81.28 74.93,82.55 E11.12 72.39,83.19 | 85.73,83.19 E12.12 | E12.10 85.73,88.27 84.46,87 84.46,84.45 85.73,83.19 | E10.10 58.42,90.81 57.15,89.53 57.15,87 58.42,85.72 E10.12 61.6,85.09 63.5,82.55 65.41,79.38 66.68,78.74 68.58,78.74 70.49,80.64 72.39,83.19 | 72.39,83.19 71.12,84.45 71.12,87 72.39,88.27 E11.10
  Bottom 0.813: E9.9 E9.10 44.45,90.81 43.18,89.53 43.18,87 44.45,85.72 E9.12 48.26,83.82 52.07,79.06 53.66,79.06 55.25,80.01 55.25,81.92 57.15,84.45 58.42,85.72 | E10.9 E10.10 | E11.10 E11.9 | E12.9 E12.10 | E12.12 88.27,82.55 88.9,81.28 88.9,77.47 90.17,76.2 94.62,76.2 95.89,77.47 97.16,85.09 98.43,90.17 99.7,92.08 108.59,96.52 116.21,98.42 116.84,99.06 116.84,103.5 E19.8
N$23
  Top 0.813: E1.4 24.13,20.32 23.5,21.59 23.5,26.04 20.96,33.66 19.05,38.73 19.05,47.62 19.69,52.7 21.59,57.78 22.23,61.59 22.23,65.41 20.96,68.58 15.24,76.2 15.24,78.74 E7.6
  Bottom 0.61: E1.4 27.94,20.95 29.85,24.13 29.85,27.94 30.48,29.21 31.75,30.48 34.93,30.48 40.01,27.3 42.55,25.4 44.45,22.86 45.72,20.32 E2.4 | E7.6 19.69,79.38 22.86,76.2 27.31,74.3 32.39,74.3 36.83,73.66 43.82,74.3 55.88,74.3 59.69,76.2 65.41,76.2 69.85,74.93 83.19,74.93 84.46,76.2 84.46,78.74 E12.13
  Bottom 0.813: R6.1 99.7,7.62 97.16,11.43 94.62,18.41 93.35,21.59 91.44,24.77 86.36,26.67 81.28,27.94 78.11,29.21 76.84,29.21 74.93,27.62 73.03,22.86 71.76,20.95 E3.4 67.31,20.95 65.41,24.13 63.5,25.4 57.15,29.84 55.25,30.16 54.61,30.16 52.39,28.57 52.07,25.4 52.07,25.08 50.17,22.23 E2.4
N$24
  Top 0.813: E7.8 22.23,75.56 20.96,73.66 20.96,71.12 22.86,68.58 23.5,66.04 23.5,57.78 20.32,47.62 20.32,40.64 20.96,38.1 22.23,34.92 24.77,31.75 26.67,29.21 27.31,27.94 27.31,24.13 E1.3
  Bottom 0.61: E2.3 45.72,23.5 43.82,26.04 34.93,31.75 31.75,31.75 30.48,31.11 29.21,29.84 28.58,27.3 28.58,24.77 27.31,22.86 E1.3 | E7.8 27.94,75.56 35.56,75.56 37.47,74.93 39.37,74.93 44.45,75.56 50.17,75.41 55.25,75.41 59.06,77.47 65.41,77.47 71.12,76.2 74.93,76.2 76.2,77.47 76.2,79.38 74.93,80.64 E11.13
  Bottom 0.813: R7.1 99.06,11.43 97.79,13.97 95.89,19.05 94.62,22.86 92.71,25.4 91.76,26.04 88.27,27.3 85.41,28.26 82.55,28.89 78.74,30.48 76.2,30.48 73.66,28.26 73.03,26.67 71.12,22.86 E3.3 65.41,26.04 62.23,27.94 58.42,30.8 55.25,31.75 54.61,31.75 51.44,29.84 50.8,27.3 50.8,25.4 E2.3
N$25
  Top 0.813: E8.8 38.74,76.2 39.37,73.03 40.64,70.48 42.55,67.94 44.45,64.77 44.45,60.96 43.82,53.98 45.09,47.62 43.82,42.55 43.82,38.1 45.09,33.66 49.21,27.94 49.21,26.99 E2.2
  Bottom 0.61: E1.2 27.31,26.04 27.94,29.21 28.58,31.11 31.12,33.02 34.93,33.02 38.74,31.11 E2.2
  Bottom 0.813: E8.8 42.55,81.28 E9.13 | R8.1 99.7,13.34 98.11,16.83 96.2,22.86 93.98,26.04 91.76,27.62 89.85,28.26 83.19,30.16 78.74,31.75 75.88,31.75 74.93,31.11 72.39,28.89 71.12,26.04 E3.2 66.04,27.3 58.74,32.07 57.15,33.02 53.98,33.02 50.17,30.48 49.53,28.57 49.53,26.04 E2.2
N$26
  Top 0.813: E2.1 45.72,28.57 42.55,33.66 41.28,37.47 41.28,40.64 43.82,47.62 42.55,49.53 36.83,51.44 36.2,52.7 36.2,54.61 38.1,56.52 41.28,59.05 43.18,61.59 43.18,64.14 34.93,76.83 E8.6
  Bottom 0.813: R9.1 99.7,17.78 97.79,22.86 96.52,25.4 94.62,27.3 92.71,28.57 89.54,29.84 87,30.48 78.74,33.02 75.57,33.02 73.66,31.75 71.12,29.53 E3.1 66.36,28.57 57.79,34.29 53.66,34.29 48.9,31.11 E2.1 40.64,31.75 35.56,34.29 30.48,34.29 27.31,31.75 E1.1 | E8.6 34.29,79.38 37.47,76.2 40.64,76.2 45.09,76.83 48.9,76.83 51.75,76.52 53.98,76.52 55.25,76.83 59.06,78.74 60.96,78.74 62.23,80.01 62.23,81.92 60.96,83.19 E10.13
N$27
  Top 0.813: E5.4 45.72,51.44 45.72,69.22 45.09,72.39 42.55,75.56 40.64,79.38 41.28,82.55 43.82,92.08 43.82,93.98 42.23,95.57 38.42,95.57 37.47,96.52 35.56,100.97 E13.8
  Bottom 0.61: E5.4 48.9,50.8 50.8,53.34 51.75,56.83 52.07,58.74 53.98,60.48 56.83,60.48 63.5,56.52 E6.4
  Bottom 0.813: E6.4 71.12,50.8 73.03,52.7 74.93,58.42 76.2,59.37 77.47,59.37 83.19,56.52 91.44,56.52 R2.1 | E13.8 36.2,103.5 43.82,102.23 47.63,102.87 56.83,101.28 58.1,101.28 61.28,102.23 65.41,102.23 67.31,102.87 69.85,102.87 71.76,102.23 76.2,103.5 79.38,103.5 80.65,104.78 80.65,106.68 79.38,107.95 E17.13 | E4.4 27.94,51.44 29.21,53.34 29.85,58.1 30.8,59.69 32.07,60.64 34.93,60.64 40.01,57.15 43.18,55.24 45.09,52.07 E5.4
N$28
  Top 0.61: 24.13,84.45 25.4,84.45
  Top 0.813: E4.3 28.58,55.88 28.58,60.33 27.31,65.41 24.13,69.22 22.23,71.75 22.23,73.03 23.5,74.3 25.4,74.93 26.67,76.83 26.67,83.19 25.4,84.45 | E13.6 24.77,106.68 30.16,101.92 31.12,100.97 31.12,98.42 29.21,96.52 23.5,94.61 22.86,93.34 22.86,85.72 24.13,84.45
  Bottom 0.61: E5.3 49.53,53.98 50.8,57.78 50.8,59.37 53.34,61.59 57.15,61.59 61.28,59.53 65.41,56.52 E6.3
  Bottom 0.813: E6.3 70.49,53.34 72.39,55.24 73.66,59.05 75.88,60.64 78.42,60.64 83.5,57.78 91.76,57.78 R3.1 | E13.6 24.77,106.68 28.58,103.5 43.82,100.97 47.63,101.6 56.52,100.01 58.42,100.01 61.6,100.97 73.03,100.97 76.2,102.23 87,102.23 88.9,104.14 90.17,106.68 E18.13 | E4.3 27.94,54.61 28.58,58.74 29.85,60.64 31.75,61.91 35.56,61.91 40.32,58.42 44.13,56.2 45.72,53.98 E5.3
N$29
  Top 0.813: E14.8 45.72,98.42 47.63,97.16 48.9,93.34 48.9,82.55 50.17,58.42 E5.2
  Bottom 0.61: E5.2 48.9,56.52 49.53,57.78 49.53,60.01 53.02,62.71 57.47,62.71 61.75,60.48 E6.2
  Bottom 0.813: E14.8 46.36,107.95 E15.13 | E6.2 70.49,55.88 71.44,56.83 72.71,60.01 75.57,61.91 78.74,61.91 83.82,59.05 92.71,59.05 R4.1 | E4.2 26.67,55.88 27.31,59.05 28.89,61.59 31.43,63.18 35.88,63.18 41.28,59.37 44.77,57.47 E5.2
N$30
  Top 0.61: 45.09,94.61 46.36,94.61
  Top 0.813: E5.1 47.63,93.34 46.36,94.61 | E14.6 43.18,100.33 43.82,99.06 43.82,95.89 45.09,94.61
  Bottom 0.61: E5.1 48.26,60.64 52.71,63.82 57.63,63.82 E6.1
  Bottom 0.813: R5.1 92.08,60.33 84.46,60.33 78.74,63.5 75.88,63.5 72.39,61.59 70.49,59.69 E6.1 | E14.6 41.91,104.14 43.82,103.5 46.99,104.14 48.9,104.14 51.44,103.5 54.61,103.5 57.15,102.55 58.1,102.55 61.28,103.5 65.41,103.5 66.68,104.78 66.68,106.68 65.41,107.95 E16.13 | E4.1 26.04,59.69 27.94,62.55 30.48,64.14 32.39,64.77 35.56,64.77 36.83,64.14 40.32,61.59 E5.1
N$31
  Top 0.813: E12.6 96.52,88.9 98.43,86.36 97.79,69.85 99.7,67.94 102.24,66.67 103.51,65.41 106.68,61.59 107.32,40.64 107.32,33.02 104.14,30.48 99.7,27.3 99.7,24.13 103.51,21.59 103.51,20.32 100.33,17.78 94.3,13.02 92.39,11.75 85.41,11.75 R14.1
  Bottom 0.813: R14.1 E3.8 74.93,7.62 73.03,6.35 70.8,5.08 67.95,5.08 65.41,5.71 60.96,10.16 E2.8 53.34,7.62 50.8,5.08 44.45,5.08 39.37,10.16 E1.8
N$32  (via drill 0.81)
  Top 0.61: 85.09,87 87.63,87
  Top 0.813: E3.9 80.65,18.1 83.19,18.1 90.17,20.95 95.89,27.94 100.33,33.02 103.51,35.56 106.05,38.1 106.05,39.37 104.14,44.45 99.06,48.26 97.16,50.8 96.52,53.98 96.52,69.22 94.62,73.66 92.08,76.2 v90.81,78.11 | E11.6 83.19,89.53 85.09,87 | 87.63,87 v89.54,85.09
  Bottom 0.813: R15.1 E3.9 75.57,13.34 74.93,12.06 74.93,10.79 73.66,8.26 70.49,6.35 68.58,6.35 66.04,6.99 62.55,10.79 58.42,12.7 E2.9 53.34,12.06 52.71,9.84 52.07,8.26 50.17,6.35 45.09,6.35 40.32,11.11 E1.9 | v89.54,85.09 v90.81,78.11
N$33
  Top 0.813: E9.6 50.8,90.81 50.8,78.11 52.07,59.05 52.07,57.15 49.53,54.61 49.53,40.01 53.02,28.89 53.02,19.37 E2.10
  Bottom 0.813: R16.1 E3.10 74.3,14.61 73.66,12.06 73.66,11.11 72.71,9.21 71.12,8.26 69.53,7.94 68.9,7.94 66.68,8.26 65.41,9.53 63.5,12.06 60.01,13.34 57.79,14.61 E2.10 53.34,15.24 52.07,12.7 51.44,10.16 51.12,9.21 49.53,7.62 45.72,7.62 41.28,12.06 36.2,14.61 E1.10
N$34
  Top 0.813: E10.6 64.77,90.81 64.77,76.83 66.04,73.03 69.22,67.31 69.22,64.14 66.68,60.96 63.5,58.42 61.91,55.24 61.91,52.7 58.42,48.9 57.15,46.35 57.79,36.83 58.42,29.21 58.42,26.67 57.15,20.95 E2.11
  Bottom 0.813: R17.1 E3.11 74.3,17.14 73.03,14.92 72.39,12.38 72.39,11.43 71.76,10.16 69.53,9.21 69.22,9.21 67.31,9.53 64.45,13.02 60.64,14.61 58.74,15.56 57.79,17.78 E2.11 52.07,15.88 50.8,13.34 50.17,10.16 48.9,8.89 46.36,8.89 42.55,12.7 39.37,14.61 36.83,15.88 E1.11
N$35
  Top 0.813: E17.6 80.65,112.39 80.65,105.41 79.69,101.28 79.69,77.79 81.92,75.56 86.36,75.56 88.9,74.93 92.08,72.39 93.35,69.85 93.35,64.77 87.63,59.05 85.73,55.88 83.19,45.72 81.92,44.45 80.65,44.45 79.38,43.18 79.38,40.64 80.01,40.01 R10.1
  Bottom 0.813: R10.1 E6.8 76.2,39.37 74.3,37.47 70.8,35.56 66.04,35.56 61.6,40.01 E5.8 54.61,39.37 52.71,37.47 50.17,35.56 43.82,35.56 39.37,40.64 E4.8
N$36
  Top 0.813: R13.1 80.65,52.07 80.65,53.98 82.55,57.78 88.9,62.23 92.08,65.41 92.08,69.53 90.81,71.75 88.27,73.66 81.28,74.3 78.11,76.83 78.11,101.6 76.2,103.5 71.12,103.5 69.85,104.78 69.85,116.2 E16.6
  Bottom 0.813: R13.1 E6.11 74.3,47.62 72.39,44.13 72.39,41.27 69.22,39.37 66.04,41.27 63.5,43.81 58.74,46.04 57.79,48.26 E5.11 52.71,47.62 50.8,45.09 50.8,41.27 48.9,39.37 45.72,39.37 45.09,40.01 43.82,41.91 41.91,43.81 37.47,45.72 34.93,48.9 E4.11
N$37
  Top 0.61: 74.93,89.53 72.39,89.53
  Top 0.813: E15.6 59.69,116.2 59.69,104.14 64.14,100.97 69.22,97.16 74.93,94.61 75.57,93.98 75.57,90.17 74.93,89.53 | R12.1 80.01,47.62 78.74,49.53 78.74,53.34 81.28,58.42 87.63,62.87 90.81,66.04 90.81,69.22 89.54,71.12 87,72.39 84.46,72.39 82.55,70.48 80.01,70.48 74.93,75.56 71.12,75.56 69.22,76.83 69.22,78.11 71.12,81.28 71.12,88.27 72.39,89.53
  Bottom 0.813: R12.1 E6.10 73.66,43.81 73.66,40.64 69.85,38.1 68.58,38.1 65.41,40.01 62.87,42.55 57.79,45.09 E5.10 52.07,44.45 52.07,40.64 49.53,38.1 45.09,38.1 41.28,42.55 36.51,44.77 34.93,46.35 E4.10
N$38
  Top 0.61: 92.71,87 95.25,87 | 95.25,81.92 92.08,81.92
  Top 0.813: R11.1 82.55,42.55 83.82,43.81 84.77,46.04 87,55.24 89.54,59.05 94.62,64.14 94.62,70.48 93.35,73.03 88.9,76.83 88.9,78.74 92.08,81.92 | E18.6 96.52,114.3 96.52,104.78 91.44,99.69 91.44,97.16 92.08,93.34 92.08,87.63 92.71,87 | 95.25,87 96.52,85.72 96.52,83.19 95.25,81.92
  Bottom 0.813: R11.1 E6.9 74.93,43.18 74.93,40.01 72.71,38.1 70.49,36.83 67.95,36.83 66.04,37.47 62.87,40.64 59.69,42.55 E5.9 53.34,43.81 53.34,40.01 51.12,37.78 49.85,36.83 44.45,36.83 41.28,40.64 40.32,41.59 39.37,41.91 E4.9
N$39
  Top 0.61: E1.7 26.67,8.89 29.85,5.71 31.75,4.45 34.93,3.17 38.1,2.54 47.63,2.54 60.33,3.17 63.5,3.81 68.58,5.71 72.39,6.35 79.38,6.99 81.92,7.62 83.82,8.89 87.63,8.89 96.52,4.45 98.43,3.81 102.87,3.81 104.78,5.08 106.05,7.62 106.05,21.59 D2.A
  Top 0.813: E4.7 25.4,37.47 30.48,28.57 30.48,17.14 E1.7
  Bottom 0.61: D2.A R18.2
  Bottom 0.813: A.J2 9.53,26.04 14.61,26.04 17.15,22.86 19.05,18.1 20,16.51 21.59,14.92 E1.7
N$40
  Top 0.61: E1.6 24.45,13.97 23.5,12.7 23.5,10.16 27.31,6.35 30.48,3.81 34.93,1.91 38.1,1.27 60.33,1.91 65.41,3.17 71.76,5.08 80.65,5.71 84.46,7.62 87.63,7.62 92.08,5.08 97.79,2.54 102.87,2.54 104.78,3.49 106.05,5.08 107.32,7.62 107.32,25.4 D3.A
  Top 0.813: E4.6 23.5,43.81 23.5,38.1 28.58,28.57 28.58,17.78 E1.6
  Bottom 0.813: A.K2 8.89,29.21 14.61,29.21 18.42,23.5 20.32,18.41 21.91,16.51 E1.6 | R19.2 D3.A
N$41  (via drill 0.81)
  Top 0.813: v38.74,64.77 E4.14 27.94,52.07 v27.94,40.01 E1.14
  Bottom 0.813: v38.74,64.77 46.99,64.77 52.71,66.67 58.42,66.67 64.77,63.5 69.85,63.5 72.71,64.77 76.52,66.04 79.06,66.04 85.73,63.5 92.08,63.5 97.16,66.04 R21.2 D5.A | v27.94,40.01 22.23,38.73 8.89,38.73 A.N2
N$42  (via drill 0.81)
  Top 0.61: E5.6 45.72,43.18 45.09,41.27 45.72,36.83 46.99,33.02 50.48,28.26 50.48,17.46 E2.6 v29.85,8.89 31.75,6.99 34.29,5.08 38.1,3.81 44.45,3.81 53.98,4.45 60.33,4.45 64.77,5.71 69.85,7.62 75.57,8.89 78.11,10.16 80.01,13.97 81.28,14.92 92.71,14.92 94.62,15.24 98.43,18.41 R23.2
  Bottom 0.61: R23.2 D8.A
  Bottom 0.813: A.F2 9.53,19.68 14.61,19.68 17.78,14.92 20.96,12.06 23.5,9.53 24.77,8.89 v29.85,8.89
N$43  (via drill 0.81)
  Top 0.813: v41.28,62.87 34.93,55.88 E4.13 31.12,53.34 v31.12,40.01 32.39,36.83 34.93,31.11 35.56,28.57 35.56,27.3 34.93,26.04 33.66,24.77 E1.13
  Bottom 0.61: v41.28,62.87 47.63,63.5 52.39,65.41 57.79,65.41 64.14,62.23 70.49,62.23 73.03,63.5 74.3,64.14 76.2,64.77 78.74,64.77 85.41,62.23 92.71,62.23 R20.2
  Bottom 0.813: R20.2 D4.A | A.L2 8.26,32.38 14.61,32.38 22.86,34.92 29.85,38.1 v31.12,40.01
N$44  (via drill 0.81)
  Top 0.61: v35.56,8.89 E2.7 51.75,15.88 51.75,28.57 48.26,39.37 E5.7 | 75.57,18.41 78.11,18.41
  Top 0.813: v35.56,8.89 36.2,6.99 38.1,5.08 59.69,5.71 66.04,7.62 70.49,10.16 72.39,12.06 72.39,15.88 75.57,18.41 | 78.11,18.41 81.28,21.59 88.27,21.59 89.54,22.23 92.08,26.04 98.43,33.66 R22.2
  Bottom 0.813: A.H2 8.89,22.86 14.61,22.86 16.51,20.32 19.05,15.56 21.59,13.34 24.13,10.79 25.08,10.16 31.75,10.16 v35.56,8.89 | R22.2 D6.A
N$45  (via drill 0.81)
  Top 0.813: v66.04,65.41 E5.13 52.71,52.7 52.71,40.01 54.61,33.02 57.15,28.57 57.15,26.67 E2.13
  Bottom 0.813: D7.A R24.2 99.7,71.75 96.52,67.94 91.44,64.77 86.04,64.77 79.38,67.31 76.2,67.31 70.49,65.41 v66.04,65.41 58.58,68.26 52.86,68.26 46.36,66.04 41.91,66.04 38.74,66.36 31.75,66.04 28.58,64.77 26.99,63.5 24.13,59.05 20.32,46.35 17.78,43.18 14.61,41.91 9.53,41.91 A.P2
N$46  (via drill 0.81)
  Top 0.61: 71.12,20.95 78.11,20.95
  Top 0.813: v59.06,8.26 E3.7 71.12,13.97 71.12,20.95 71.12,29.21 69.22,36.83 E6.7 | 78.11,20.95 80.65,22.86 87.63,22.86 90.81,26.67 97.16,36.2 R26.2
  Bottom 0.813: A.D2 9.53,13.34 14.61,13.34 16.51,12.38 21.59,7.62 23.18,6.67 27.94,5.71 31.12,4.45 32.39,3.81 50.8,3.81 51.44,3.81 55.25,5.71 v59.06,8.26 | R26.2 D10.A
N$47  (via drill 0.81)
  Top 0.813: v64.14,67.94 E5.14 50.8,53.34 50.8,40.01 E2.14
  Bottom 0.61: 46.36,67.31 52.71,69.37 59.06,69.37 v64.14,67.94
  Bottom 0.813: v64.14,67.94 68.58,67.31 71.76,67.31 76.2,68.58 79.69,68.58 86.36,66.04 90.81,66.04 95.25,69.85 99.06,74.93 R25.2 D9.A | A.R2 8.89,45.09 17.15,45.09 18.42,46.35 20.32,51.44 22.23,57.78 23.18,60.01 24.45,62.23 25.4,63.5 26.04,64.45 27.62,65.72 31.43,67.31 31.75,67.31 39.37,67.63 41.91,67.31 46.36,67.31
N$48  (via drill 0.81)
  Top 0.813: v87.63,67.94 80.65,62.23 E6.14 71.76,53.34 71.76,40.01 72.39,35.56 74.93,29.84 E3.14
  Bottom 0.61: 46.36,68.58 52.71,70.48 64.77,70.48
  Bottom 0.813: D13.A R29.2 99.06,80.01 98.43,76.52 95.89,73.03 92.08,69.85 v87.63,67.94 85.09,67.94 80.01,69.85 76.2,69.85 71.12,68.58 69.85,68.58 64.77,70.48 | A.S2 9.53,48.9 14.61,48.9 17.78,51.44 19.69,54.61 21.59,59.69 23.18,62.87 25.08,65.41 26.67,66.67 29.53,68.26 30.48,68.58 32.39,68.58 39.37,68.9 42.55,68.58 46.36,68.58
N$49  (via drill 0.81)
  Top 0.813: 67.95,14.61 55.88,9.53 43.18,6.99 v38.74,6.99 | E6.6 67.31,43.81 66.68,41.27 66.68,36.2 v67.95,33.02 66.68,30.48 66.04,24.77 66.04,18.41 67.95,14.61 | E3.6 67.95,14.61
  Bottom 0.813: v38.74,6.99 36.83,5.71 31.75,5.71 27.31,7.62 24.77,7.62 23.5,7.94 22.23,8.89 16.83,13.97 14.61,16.51 8.89,16.51 A.E2 | v67.95,33.02 71.12,34.29 76.2,36.83 91.44,36.83 94.62,38.1 98.43,42.55 R27.2 D12.A
N$52  (via drill 0.81)
  Top 0.813: v85.73,70.48 88.27,69.85 89.54,68.58 89.54,66.67 88.9,66.04 85.73,63.5 80.01,59.05 78.11,55.88 E6.13 74.3,52.7 74.3,40.01 79.38,29.84 79.38,27.94 78.11,25.4 E3.13
  Bottom 0.61: 46.36,69.85 53.02,71.6 65.25,71.6
  Bottom 0.813: D11.A R28.2 99.7,87 97.79,81.28 97.16,76.83 95.25,74.3 92.08,72.39 v85.73,70.48 81.92,70.48 80.01,71.12 76.2,71.12 71.12,69.85 65.25,71.6 | A.T2 9.53,52.07 14.61,52.07 17.78,54.61 20.32,60.33 22.23,64.14 24.13,66.36 27.94,69.22 29.85,69.85 35.56,70.17 40.64,70.17 43.18,69.85 46.36,69.85
VCC  (via drill 0.81)
  Top 0.813: E5.12 67.95,64.77 67.95,66.67 66.68,68.58 64.14,70.48 62.23,71.12 60.33,71.12 58.42,70.48 55.88,70.48 54.61,72.39 54.61,73.66 57.15,76.83 C24.1 57.15,88.27 58.42,92.08 54.61,97.16 53.34,97.79 52.07,97.79 v50.17,95.89 E15.14 53.98,110.49 v53.98,120.65 56.52,122.56 60.96,123.83 | E1.12 34.93,23.5 36.83,26.04 36.83,27.94 36.2,36.83 37.47,43.81 C12.1 | C38.1 74.93,109.86 74.93,112.39 73.66,118.11 73.34,120.02 73.66,122.56 | 73.66,122.56 v71.12,127.64 60.96,123.83 | 60.96,123.83 62.23,121.92 62.87,119.38 61.6,115.57 61.6,108.58 62.23,107.31 E16.14 67.31,102.87 71.12,100.97 76.2,95.89 76.84,93.98 76.84,81.28 E11.14 | C30.1 C32.1 42.55,120.65 E14.14 | C4.+ 111.76,98.42 111.76,118.11 E19.14 | E7.14 27.31,93.34 30.48,95.25 C18.1 E8.14 | E12.14 91.44,83.19 91.44,85.09 90.81,86.36 90.81,92.71 85.09,98.42 85.09,100.97 88.9,104.14 E18.14 94.62,107.31 94.62,121.28 93.35,122.56 | 73.66,122.56 93.35,122.56 | 93.35,122.56 98.43,127 C42.1
  Bottom 0.813: v71.12,127.64 64.77,128.27 54.61,130.18 21.59,130.18 17.78,128.27 8.26,128.27 B.V2 | E1.12 36.2,20.32 C6.1 40.64,15.24 43.82,13.34 46.99,10.16 48.26,10.16 48.9,10.79 49.53,13.97 50.17,15.24 52.71,19.68 E2.12 58.42,20.32 C8.1 62.23,15.24 65.41,13.97 67.95,10.79 69.22,10.48 70.8,11.11 71.76,15.24 73.66,19.05 E3.12 78.74,22.86 C10.1 | C16.1 E6.12 73.03,48.9 71.12,44.45 71.12,41.91 69.22,40.96 66.99,42.23 66.04,43.81 C14.1 58.42,50.16 E5.12 52.07,49.53 49.53,45.72 49.53,41.91 48.26,40.64 46.36,40.64 43.82,44.45 40.64,45.72 C12.1 36.83,50.16 E4.12 | E8.14 C20.1 43.18,96.52 45.09,97.79 46.99,97.79 v50.17,95.89 | C22.1 E9.14 48.26,80.01 51.59,77.79 53.82,77.79 C24.1 E10.14 | E13.14 C30.1 | C40.1 E18.14 | C42.1 106.05,123.83 109.86,121.92 E19.14 | C34.1 E15.14 | C26.1 E11.14 | C28.1 83.82,73.66 85.73,75.56 E12.14 | C38.1 E17.14 | C36.1 E16.14 | E14.14 48.26,122.56 51.44,122.56 v53.98,120.65

### Text on the board
Top: FLIP CHIP
Bottom: FM MODULE | B250D